# EAGLE design audio amplifier (EAGLE 9.6.2)
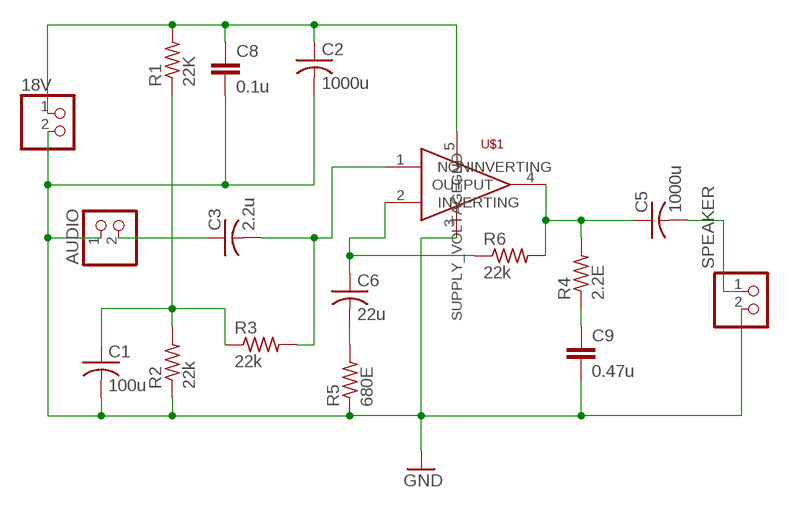
[diagram p0: schematic, sheet 1]

## Parts
18V  PINHD-1X2  [1X02]
AUDIO  PINHD-1X2  [1X02]
C1  100u  C-US025-024X044  [C025-024X044]
C2  1000u  C-US025-024X044  [C025-024X044]
C3  2.2u  C-US025-024X044  [C025-024X044]
C5  1000u  C-US025-024X044  [C025-024X044]
C6  22u  C-US025-024X044  [C025-024X044]
C8  0.1u  C-EU025-025X050  [C025-025X050]
C9  0.47u  C-EU025-025X050  [C025-025X050]
R1  22K  R-US_0204/7  [0204/7]
R2  22k  R-US_0204/7  [0204/7]
R3  22k  R-US_0204/7  [0204/7]
R4  2.2E  R-US_0204/7  [0204/7]
R5  680E  R-US_0204/7  [0204/7]
R6  22k  R-US_0204/7  [0204/7]
SPEAKER  PINHD-1X2  [1X02]
U$1  TDA2050  [PENTAWATT]

## Nets
GND: 18V.2 AUDIO.1 C1.2 C2.2 C8.2 C9.2 R2.1 R5.1 SPEAKER.2 U$1.3(GND)
N$1: 18V.1 C2.1 C8.1 R1.2 U$1.5(SUPPLY_VOLTAGE)
N$3: AUDIO.2 C3.1
N$4: C3.2 R3.2 U$1.1(NONINVERTING)
N$5: C6.2 R5.2
N$6: C6.1 R6.1 U$1.2(INVERTING)
N$7: C1.1 R1.1 R2.2 R3.1
N$8: C9.1 R4.1
N$9: C5.1 R4.2 R6.2 U$1.4(OUTPUT)
N$10: C5.2 SPEAKER.1

## Library data of the parts
18V AUDIO SPEAKER = pinhead:PINHD-1X2: PIN HEADER
C1-C3 C5 C6 = rcl:C-US: CAPACITOR, American symbol; SPICEPREFIX: C
C8 C9 = rcl:C-EU: CAPACITOR, European symbol; SPICEPREFIX: C
R1-R6 = rcl:R-US_: RESISTOR, American symbol; SPICEPREFIX: R
U$1 = TDA2050:TDA2050: Check prices <https://pricing.snapeda.com/parts/TDA2050/STMicroelectronics/view-part?ref=eda>; AVAILABILITY: Not in stock; DESCRIPTION: Amplifier IC 1-Channel (Mono) Class AB 5-PENTAWATT; MF: STMicroelectronics; MP: TDA2050; PACKAGE: Pentawatt-5 NXP Semiconductors; PRICE: None

## Board
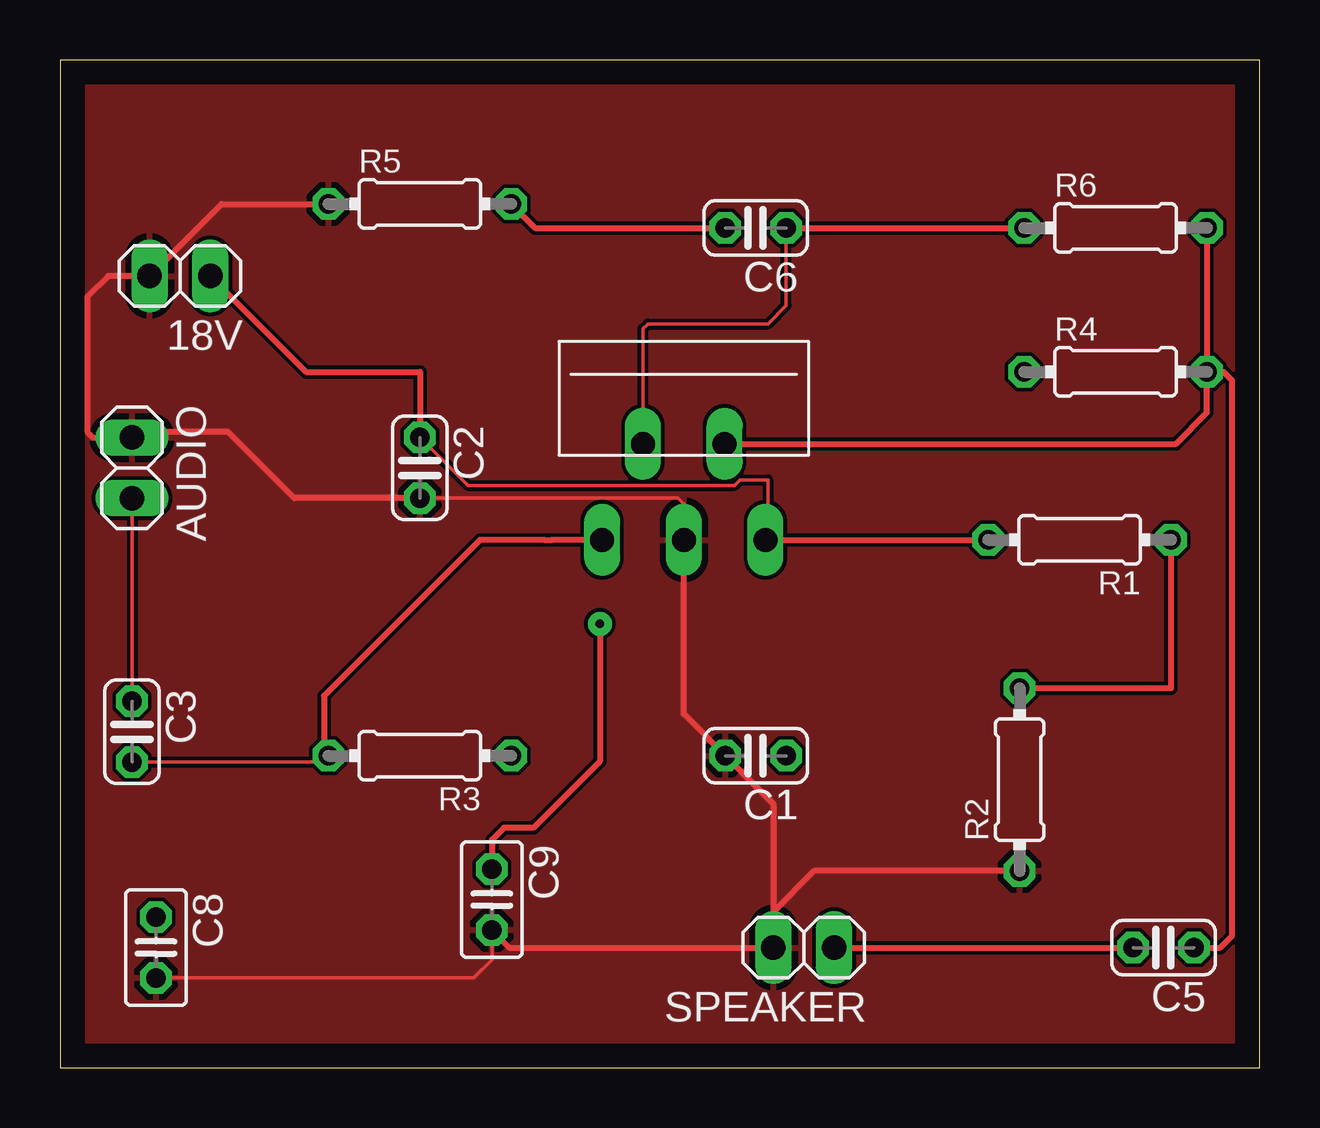
[diagram p1: board, top side]
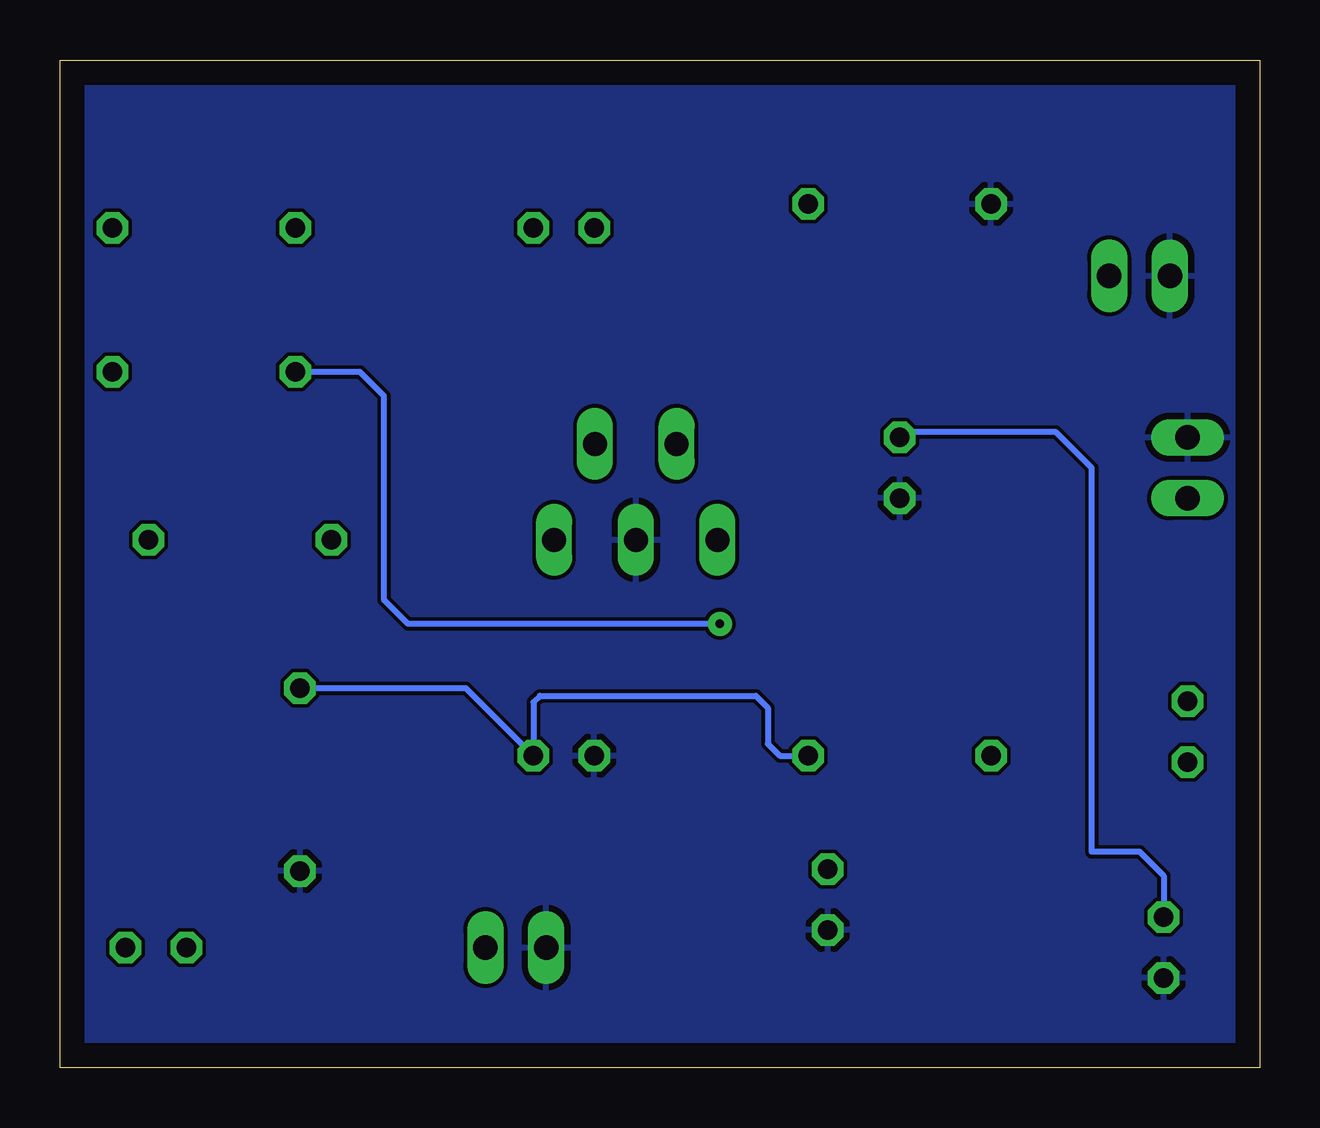
[diagram p2: board, bottom side, seen from below]

Size 50 x 42 mm. Coordinates in mm from the lower left corner, seen from the top.
Outline: 0,0 50,0 50,42 0,42 0,0
Copper layers (1*16): Top 0.035mm / dielectric 1.5mm / Bottom 0.035mm
Design rules "default": minimum track width 6mil, minimum drill 0.35mm, track to track 6mil, track to pad 6mil, pad to pad 6mil, via to via 6mil, smd to smd 6mil, copper to edge 40mil, drill to drill 6mil, minimum pad ring 10mil, minimum via ring 8mil, stop-mask expansion 4mil, vias tented up to drill 0mil, thermal gap 10mil

### Footprints (pad centres in the part's own frame; a part is rotated, then mirrored left to right if it is on the bottom)
1X02 = drill 1.016 long: 1 -1.27,0; 2 1.27,0
C025-024X044 = drill 0.813 octagon: 1 -1.27,0; 2 1.27,0
C025-025X050 = drill 0.813 octagon: 1 -1.27,0; 2 1.27,0
0204/7 = drill 0.813 octagon: 1 -3.81,0; 2 3.81,0
PENTAWATT = drill 1 long: 1 -3.4,0; 2 -1.7,4; 3 0,0; 4 1.7,4; 5 3.4,0

### Placement (x,y rotation side)
18V  5,33 180 top
AUDIO  3,25 270 top
C1  29,13 180 top
C2  15,25 270 top
C3  3,14 270 top
C5  46,5 180 top
C6  29,35 180 top
C8  4,5 270 top
C9  18,7 270 top
R1  42.5,22 180 top
R2  40,12 90 top
R3  15,13 180 top
R4  44,29 0 top
R5  15,36 0 top
R6  44,35 0 top
SPEAKER  31,5 180 top
U$1  26,22 0 top

### Tracks (layer width: path | path; a pad name or v marks a point on that pad's centre or on a via)
GND
  Top 0.152: C8.2 17.23,3.73 18,4.5 C9.2 | C2.2 22.19,23.73 22.19,23.74 25.76,23.74 26,23.5 U$1.3
  Top 0.254: 29.73,6.5 29.73,11 C1.2 26,14.73 U$1.3 | 29.73,6.5 SPEAKER.2 18.73,5 C9.2 | R5.1 6.73,36 18V.2 2,33 1.14,32.14 1.14,26.5 1.37,26.27 AUDIO.1 3.23,26.5 7,26.5 9.77,23.73 C2.2 | R2.1 31.42,8.19 29.73,6.5
  pour Top: 0,42 50,42 50,0 0.5,0 0,-0.5
  pour Bottom: 0,42 50,42 50,0 0,0
N$1
  Top 0.152: C2.1 17.01,24.26 28.11,24.26 28.34,24.5 29.5,24.5 29.5,22.1 U$1.5
  Top 0.254: 18V.1 10.27,29 15,29 C2.1 | U$1.5 R1.2
  Bottom 0.254: C8.1 4,8 5,9 7,9 7,25 8.5,26.5 14.77,26.5 C2.1
N$3
  Top 0.152: AUDIO.2 C3.1
N$4
  Top 0.152: C3.2 10.92,12.73 11.1,12.9 R3.2
  Top 0.254: U$1.1 20.5,22 20.19,22 17.5,22 11,15.5 11,13 11.1,12.9
N$5
  Top 0.254: R5.2 19.81,35 C6.2
N$6
  Top 0.152: U$1.2 24.3,30.8 24.5,31 29.5,31 30.27,31.77 C6.1
  Top 0.254: C6.1 R6.1
N$7
  Top 0.254: R1.1 46.31,15.81 R2.2
  Bottom 0.254: R2.2 33.08,15.81 C1.1 30.27,15.23 30,15.5 21,15.5 20.5,15 20.5,13.5 20,13 R3.1
N$8  (via drill 0.35 pad 1)
  Top 0.254: v22.5,18.5 22.5,12.77 19.73,10 18.5,10 18,9.5 C9.1
  Bottom 0.254: v22.5,18.5 35.5,18.5 36.5,19.5 36.5,28 37.5,29 R4.1
N$9
  Top 0.254: C5.1 48.36,5 48.86,5.5 48.86,28.64 48.5,29 R4.2 | R6.2 R4.2 | U$1.4 46.5,26 47.81,27.31 R4.2
N$10
  Top 0.254: SPEAKER.1 C5.2